# Altium schematic sheet POWER.SchDoc: POWER
size A3; Author: Silvio Navaretti; CompanyName: ARDUINO; DrawnBy: Silvio Navaretti; Engineer: Silvio Navaretti; Organization: ARDUINO; SheetNumber: 38; SheetTotal: 51; RevAuthor: Silvio Navaretti
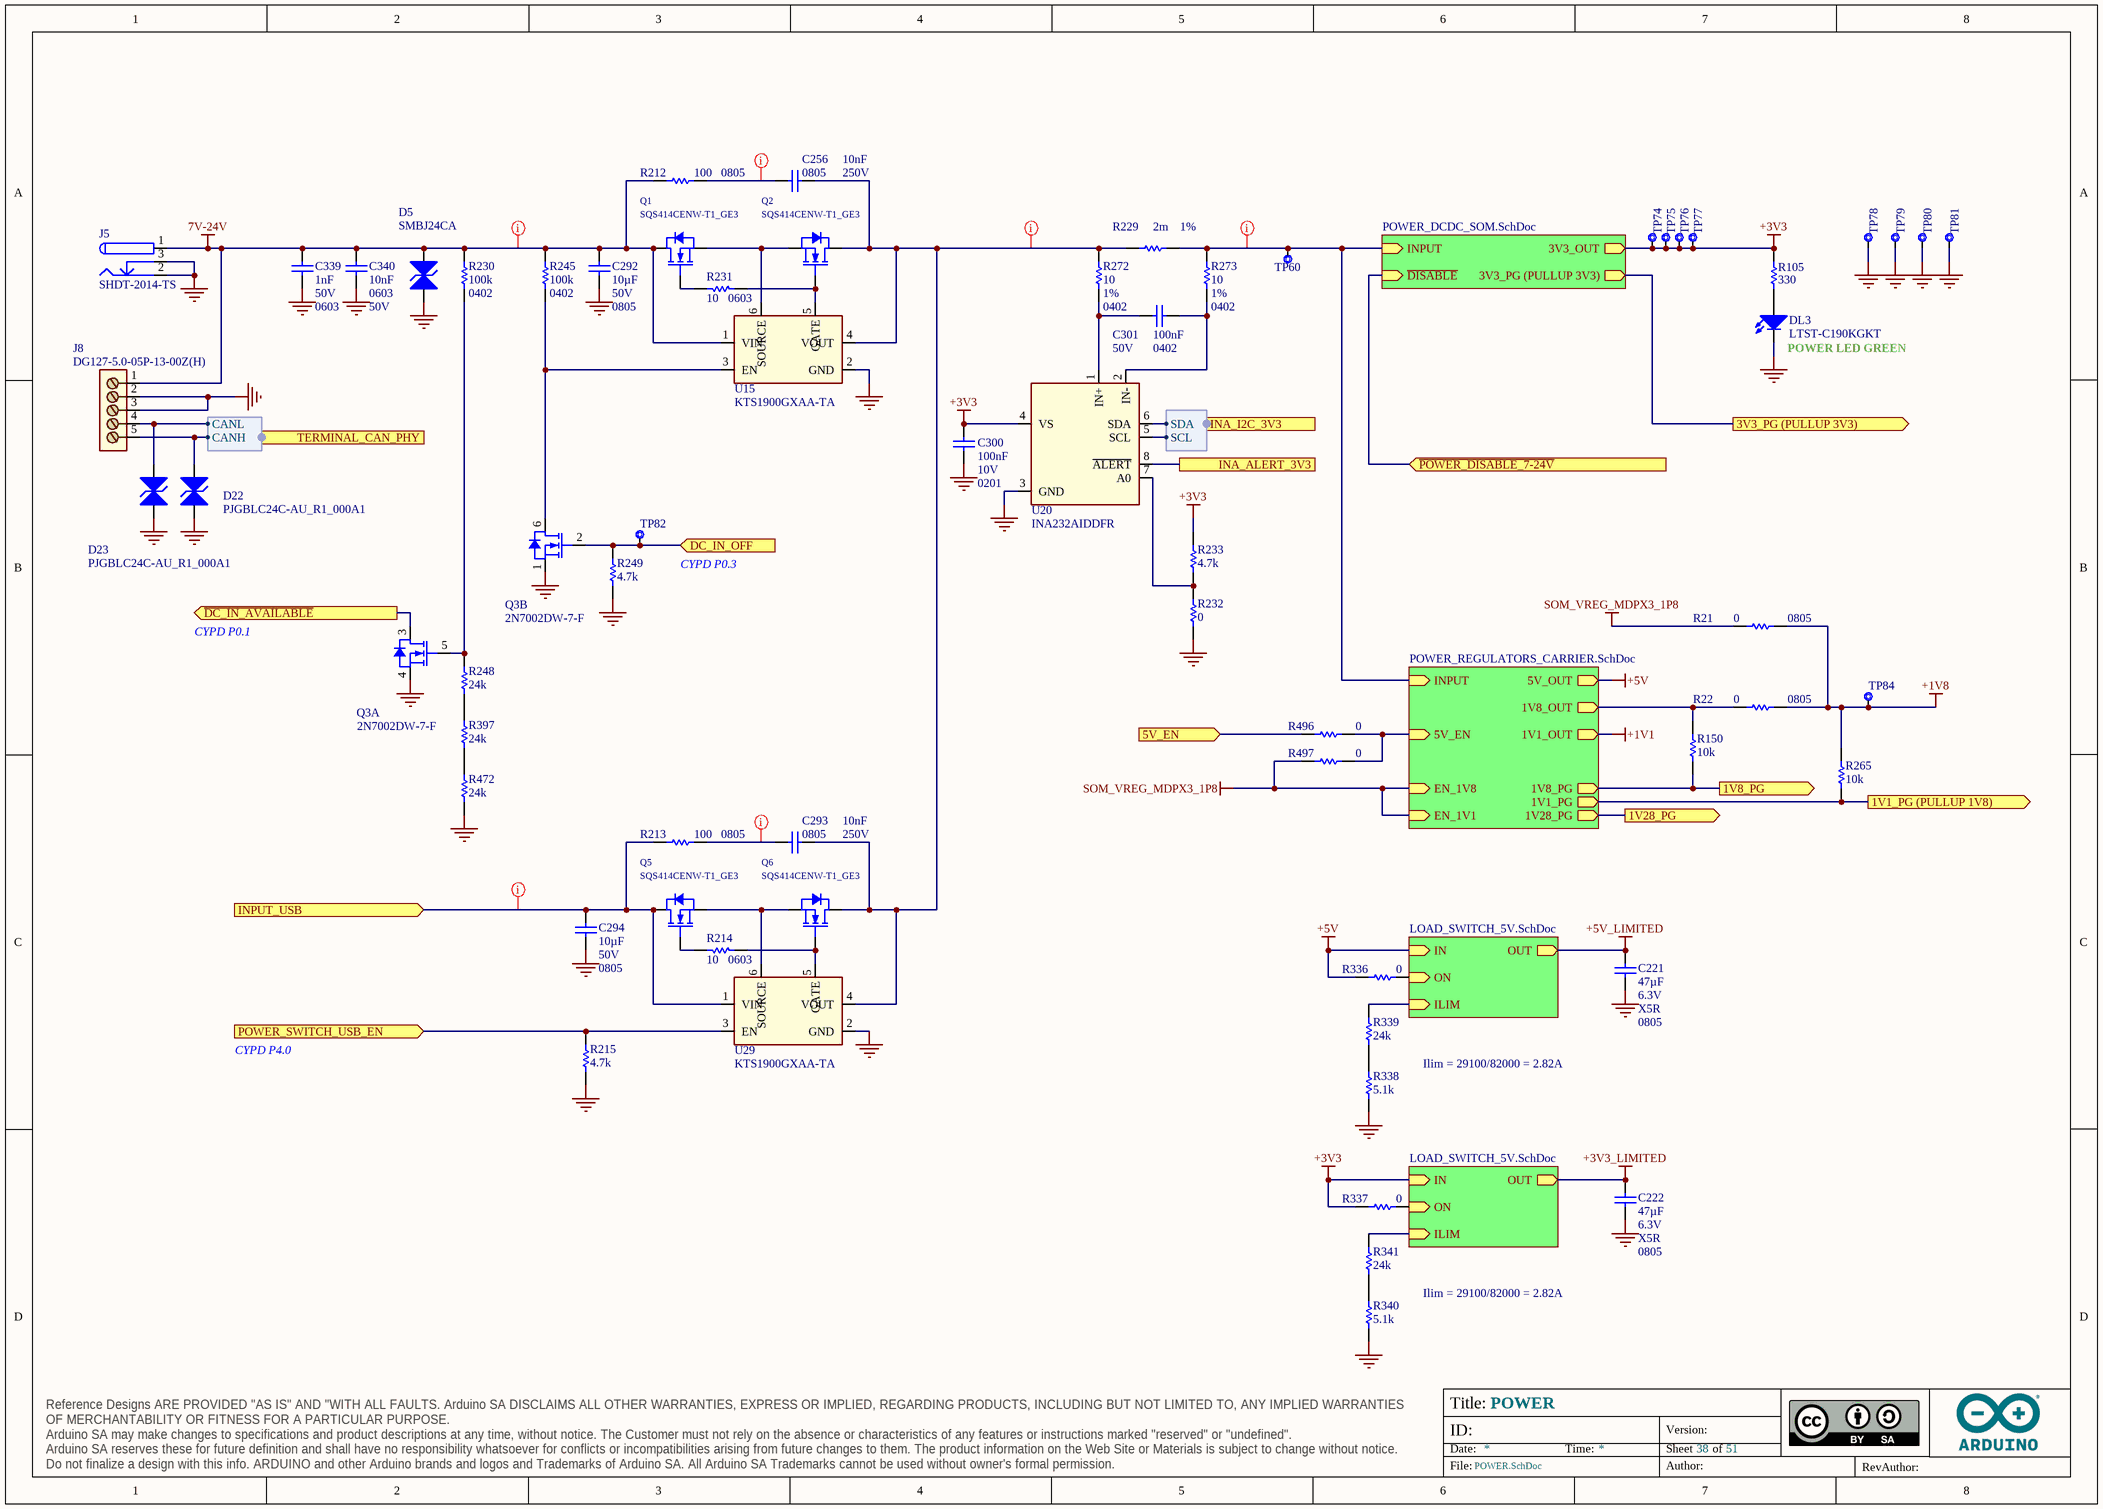
[diagram p0: POWER.SchDoc]

## Parts
C221  value 47µF  Voltage: 6.3V  Dielectric: X5R  Case Code (Imperial): 0805  [CAP-0805]  (hidden comment: C0805C476M9PAC7800)
C222  value 47µF  Voltage: 6.3V  Dielectric: X5R  Case Code (Imperial): 0805  [CAP-0805]  (hidden comment: C0805C476M9PAC7800)
C256  value 10nF  Case Code (Imperial): 0805  Voltage: 250V  [CAP-0805]  (hidden comment: GRM21BR72E103KW03L)
C292  value 10µF  Voltage: 50V  Case Code (Imperial): 0805  [CAP-0805]  (hidden comment: GRM21BR61H106ME43L)
C293  value 10nF  Case Code (Imperial): 0805  Voltage: 250V  [CAP-0805]  (hidden comment: GRM21BR72E103KW03L)
C294  value 10µF  Voltage: 50V  Case Code (Imperial): 0805  [CAP-0805]  (hidden comment: GRM21BR61H106ME43L)
C300  value 100nF  Voltage: 10V  Case Code (Imperial): 0201  [CAP-0201]  (hidden comment: CL03A104KP3NNNC)
C301  value 100nF  Voltage: 50V  Case Code (Imperial): 0402  [CAP-0402]  (hidden comment: GRM155R61H104KE19D)
C339  value 1nF  Voltage: 50V  Case Code (Imperial): 0603  [CAP-0603]  (hidden comment: CL10B102KB8WPNC)
C340  value 10nF  Case Code (Imperial): 0603  Voltage: 50V  [CAP-0603]  (hidden comment: 0603B103K500CT)
D5  SMBJ24CA  [SMB_NOPOLARITY]
D22  PJGBLC24C-AU_R1_000A1  [SOD323 NO POLARITY]
D23  PJGBLC24C-AU_R1_000A1  [SOD323 NO POLARITY]
DL3  LTST-C190KGKT  [LEDC1608X80N-AK]
J5  SHDT-2014-TS  [SHDT-2014-TS]
J8  DG127-5.0-05P-13-00Z(H)  [DG127-5.0-05P-13-00Z(H)]
Q1  SQS414CENW-T1_GE3  [SQS414CENW-T1_GE3]
Q2  SQS414CENW-T1_GE3  [SQS414CENW-T1_GE3]
Q3  2N7002DW-7-F  [SOT363]  (parts A,B of 2)
Q5  SQS414CENW-T1_GE3  [SQS414CENW-T1_GE3]
Q6  SQS414CENW-T1_GE3  [SQS414CENW-T1_GE3]
R21  value 0  Case Code (Imperial): 0805  [RES-0805]  (hidden comment: RC0805FR-070RL)
R22  value 0  Case Code (Imperial): 0805  [RES-0805]  (hidden comment: RC0805FR-070RL)
R105  value 330  [RES-0201]  (hidden comment: AC0201FR-07330RL)
R150  value 10k  [RES-0201]  (hidden comment: RC0201FR-0710KL)
R212  value 100  Case Code (Imperial): 0805  [RES-0805]  (hidden comment: RC0805FR-07100RL)
R213  value 100  Case Code (Imperial): 0805  [RES-0805]  (hidden comment: RC0805FR-07100RL)
R214  value 10  Case Code (Imperial): 0603  [RES-0603]  (hidden comment: CRCW060310R0FKEAC)
R215  value 4.7k  [RES-0201]  (hidden comment: RC0201FR-074K7L)
R229  value 2m  Tolerance: 1%  [RES-0805]  (hidden comment: PMR10EZPFV2L00)
R230  value 100k  Case Code (Imperial): 0402  [RES-0402]  (hidden comment: CRCW0402100KFKEDC)
R231  value 10  Case Code (Imperial): 0603  [RES-0603]  (hidden comment: CRCW060310R0FKEAC)
R232  value 0  [RES-0201]  (hidden comment: CRCW02010000Z0ED)
R233  value 4.7k  [RES-0201]  (hidden comment: RC0201FR-074K7L)
R245  value 100k  Case Code (Imperial): 0402  [RES-0402]  (hidden comment: CRCW0402100KFKEDC)
R248  value 24k  [RES-0201]  (hidden comment: RC0201FR-0724KL)
R249  value 4.7k  [RES-0201]  (hidden comment: RC0201FR-074K7L)
R265  value 10k  [RES-0201]  (hidden comment: RC0201FR-0710KL)
R272  value 10  Tolerance: 1%  Case Code (Imperial): 0402  [RES-0402]  (hidden comment: RC0402FR-0710RL)
R273  value 10  Tolerance: 1%  Case Code (Imperial): 0402  [RES-0402]  (hidden comment: RC0402FR-0710RL)
R336  value 0  [RES-0201]  (hidden comment: CRCW02010000Z0ED)
R337  value 0  [RES-0201]  (hidden comment: CRCW02010000Z0ED)
R338  value 5.1k  [RES-0201]  (hidden comment: ERJ-1GNF5101C)
R339  value 24k  [RES-0201]  (hidden comment: RC0201FR-0724KL)
R340  value 5.1k  [RES-0201]  (hidden comment: ERJ-1GNF5101C)
R341  value 24k  [RES-0201]  (hidden comment: RC0201FR-0724KL)
R397  value 24k  [RES-0201]  (hidden comment: RC0201FR-0724KL)
R472  value 24k  [RES-0201]  (hidden comment: RC0201FR-0724KL)
R496  value 0  [RES-0201]  (hidden comment: CRCW02010000Z0ED)
R497  value 0  [RES-0201]  (hidden comment: CRCW02010000Z0ED)
TP60  Test point 1.00mm  [TP-1.00MM]  (value not drawn)  (no BOM)
TP74  Test point 1.00mm  [TP-1.00MM]  (value not drawn)  (no BOM)
TP75  Test point 1.00mm  [TP-1.00MM]  (value not drawn)  (no BOM)
TP76  Test point 1.00mm  [TP-1.00MM]  (value not drawn)  (no BOM)
TP77  Test point 1.00mm  [TP-1.00MM]  (value not drawn)  (no BOM)
TP78  Test point 1.00mm  [TP-1.00MM]  (value not drawn)  (no BOM)
TP79  Test point 1.00mm  [TP-1.00MM]  (value not drawn)  (no BOM)
TP80  Test point 1.00mm  [TP-1.00MM]  (value not drawn)  (no BOM)
TP81  Test point 1.00mm  [TP-1.00MM]  (value not drawn)  (no BOM)
TP82  Test point 1.00mm  [TP-1.00MM]  (value not drawn)  (no BOM)
TP84  Test point 1.00mm  [TP-1.00MM]  (value not drawn)  (no BOM)
U15  KTS1900GXAA-TA  [SOT23-6 PITCH 0.95]
U20  INA232AIDDFR  [TI DDF SOT23-THIN 8 pin 1.6x2.9x1.1 mm heigth]
U29  KTS1900GXAA-TA  [SOT23-6 PITCH 0.95]

## Sub-sheets
U_LOAD_SWITCH_5V = LOAD_SWITCH_5V.SchDoc: IN (in), OUT (out), ON (in), ILIM (in)
U_LOAD_SWITCH_5V = LOAD_SWITCH_5V.SchDoc: IN (in), OUT (out), ON (in), ILIM (in)
U_POWER_DCDC_CARRIER = POWER_REGULATORS_CARRIER.SchDoc: INPUT (in), 5V_EN (in), 1V8_PG (out), 1V8_OUT (out), 1V1_OUT (out), 5V_OUT (out), 1V28_PG (out), 1V1_PG (out), EN_1V8 (in), EN_1V1 (in)
U_POWER_SOM = POWER_DCDC_SOM.SchDoc: 3V3_OUT (out), INPUT (in), ~{DISABLE} (in), 3V3_PG (PULLUP 3V3) (out)

## Ports
1V1_PG (PULLUP 1V8) (out), 1V8_PG (out), 1V28_PG (out), 3V3_PG (PULLUP 3V3) (out), 5V_EN (in), DC_IN_OFF (in), INA_ALERT_3V3, INA_I2C_3V3 (harness I2C), INPUT_USB (in), POWER_SWITCH_USB_EN (in), TERMINAL_CAN_PHY (harness CAN_PHY), ~{DC_IN_AVAILABLE} (out), ~{POWER_DISABLE_7-24V} (in)

## Harnesses
CAN_PHY: CANH, CANL
I2C: SDA, SCL

## Nets
7V-24V: C292.2 C339.1 C340.1 D5.2(A2) J5.1 J8.1 Q1.D R212.2 R230.1 R245.1 U15.1(VIN)
+1V1: sheet U_POWER_DCDC_CARRIER/1V1_OUT
+1V8: R21.2 R22.2 R265.1 TP84.X
+3V3: C300.2 R105.2 R233.1 R337.1 TP74.X TP75.X TP76.X TP77.X U20.4(VS) ; sheet U_POWER_SOM/3V3_OUT, sheet U_LOAD_SWITCH_5V/IN
+3V3_LIMITED: C222.2 ; sheet U_LOAD_SWITCH_5V/OUT
+5V: R336.1 ; sheet U_POWER_DCDC_CARRIER/5V_OUT, sheet U_LOAD_SWITCH_5V/IN
+5V_LIMITED: C221.2 ; sheet U_LOAD_SWITCH_5V/OUT
GND: C221.1 C222.1 C292.1 C294.1 C300.1 C339.2 C340.2 D5.1(A1) D22.1(A1) D23.1(A1) DL3.C J5.2 J5.3 J8.2 J8.3 Q3.1(S) Q3.4(S) R215.2 R232.1 R249.2 R338.1 R340.1 R472.1 TP78.X TP79.X TP80.X TP81.X U15.2(GND) U20.3(GND) U29.2(GND)
SOM_VREG_MDPX3_1P8: R21.1 R497.2 ; sheet U_POWER_DCDC_CARRIER/EN_1V8, sheet U_POWER_DCDC_CARRIER/EN_1V1
1V1_PG (PULLUP 1V8): R265.2 ; port 1V1_PG (PULLUP 1V8), sheet U_POWER_DCDC_CARRIER/1V1_PG
1V8_PG: R150.2 ; port 1V8_PG, sheet U_POWER_DCDC_CARRIER/1V8_PG
1V28_PG: port 1V28_PG, sheet U_POWER_DCDC_CARRIER/1V28_PG
3V3_PG (PULLUP 3V3): port 3V3_PG (PULLUP 3V3), sheet U_POWER_SOM/3V3_PG (PULLUP 3V3)
5V_EN: R496.2 ; port 5V_EN
~{DC_IN_AVAILABLE}: Q3.3(D) ; port ~{DC_IN_AVAILABLE}
DC_IN_OFF: Q3.2(G) R249.1 TP82.X ; port DC_IN_OFF
INA_ALERT_3V3: U20.8(~{ALERT}) ; port INA_ALERT_3V3
INPUT_USB: C294.2 Q5.D R213.2 U29.1(VIN) ; port INPUT_USB
~{POWER_DISABLE_7-24V}: port ~{POWER_DISABLE_7-24V}, sheet U_POWER_SOM/~{DISABLE}
POWER_SWITCH_USB_EN: R215.1 U29.3(EN) ; port POWER_SWITCH_USB_EN
NetC256_1: C256.1 R212.1
NetC256_2: C256.2 C293.2 Q2.D Q6.D R229.1 R272.2 U15.4(VOUT) U29.4(VOUT)
NetC293_1: C293.1 R213.1
NetC301_1: C301.1 R272.1 U20.1(IN+)
NetC301_2: C301.2 R273.1 U20.2(IN-)
NetD22_2: D22.2(A2) J8.5 ; port TERMINAL_CAN_PHY.CANH
NetD23_2: D23.2(A2) J8.4 ; port TERMINAL_CAN_PHY.CANL
NetDL3_A: DL3.A R105.1
NetQ1_G: Q1.G R231.2
NetQ1_S: Q1.S Q2.S U15.6(SOURCE)
NetQ2_G: Q2.G R231.1 U15.5(GATE)
NetQ3_5: Q3.5(G) R230.2 R248.2
NetQ3_6: Q3.6(D) R245.2 U15.3(EN)
NetQ5_G: Q5.G R214.2
NetQ5_S: Q5.S Q6.S U29.6(SOURCE)
NetQ6_G: Q6.G R214.1 U29.5(GATE)
NetR22_1: R22.1 R150.1 ; sheet U_POWER_DCDC_CARRIER/1V8_OUT
NetR229_2: R229.2 R273.2 TP60.X ; sheet U_POWER_SOM/INPUT, sheet U_POWER_DCDC_CARRIER/INPUT
NetR232_2: R232.2 R233.2 U20.7(A0)
NetR248_1: R248.1 R397.2
NetR336_2: R336.2 ; sheet U_LOAD_SWITCH_5V/ON
NetR337_2: R337.2 ; sheet U_LOAD_SWITCH_5V/ON
NetR338_2: R338.2 R339.1
NetR339_2: R339.2 ; sheet U_LOAD_SWITCH_5V/ILIM
NetR340_2: R340.2 R341.1
NetR341_2: R341.2 ; sheet U_LOAD_SWITCH_5V/ILIM
NetR397_1: R397.1 R472.2
NetR496_1: R496.1 R497.1 ; sheet U_POWER_DCDC_CARRIER/5V_EN
NetU20_5: U20.5(SCL) ; port INA_I2C_3V3.SCL
NetU20_6: U20.6(SDA) ; port INA_I2C_3V3.SDA

## Layout directives
net class HIGH_CLEARANCE: 7V-24V, INPUT_USB, NetC256_1, NetC256_2, NetC293_1, NetR229_2

## Notes on the sheet
- (near DL3) POWER LED GREEN
- CYPD P0.3
- CYPD P0.1
- CYPD P4.0
- Ilim = 29100/82000 = 2.82A
- Title:
- ID:
- Date:
- Time:
- Version:
- Sheet
- of
- RevAuthor:
- Reference Designs ARE PROVIDED "AS IS" AND "WITH ALL FAULTS. Arduino SA DISCLAIMS ALL OTHER WARRANTIES, EXPRESS OR IMPLIED, REGARDING PRODUCTS, INCLUDING BUT NOT LIMITED TO, ANY IMPLIED WARRANTIES OF MERCHANTABILITY OR FITNESS FOR A PARTICULAR PURPOSE.
  Arduino SA may make changes to specifications and product descriptions at any time, without notice. The Customer must not rely on the absence or characteristics of any features or instructions marked "reserved" or "undefined".
  Arduino SA reserves these for future definition and shall have no responsibility whatsoever for conflicts or incompatibilities arising from future changes to them. The product information on the Web Site or Materials is subject to change without notice.
  Do not finalize a design with this info. ARDUINO and other Arduino brands and logos and Trademarks of Arduino SA. All Arduino SA Trademarks cannot be used without owner's formal permission.
- File:
- Author:

## Library data of the parts
C221 C222 = C0199-A.1: CAP CHIP 0805 47uF 20% 6.3V X5R; Manufacturer: KEMET; Code Arduino: C0199; Technology: Ceramic; Tolerance: 20%; Part Number: C0805C476M9PAC7800
C256 C293 = C0209-A.1: CAP CHIP 0805 10nF 250V X7R; Manufacturer: Murata; Tolerance: 10%; Code Arduino: C0209; Part Number: GRM21BR72E103KW03L; Dielectric: X7R; Technology: Ceramic
C292 C294 = C0158-A.3: CAP CHIP 0805 10uF 20% 50V X5R; Manufacturer: Murata Electronics; Code Arduino: C0158; Dielectric: X5R; Technology: SMD; Part Number: GRM21BR61H106ME43L; Tolerance: 20%
C300 = C0113-A.6: CAP CHIP 0201 100nF 10% 10V X5R; Manufacturer: Samsung Electro-Mechanics; Code Arduino: C0113; Technology: Ceramic; Part Number: CL03A104KP3NNNC; Dielectric: X5R; Tolerance: 10%
C301 = C0015-A.14: CAP CHIP 0402 100nF 10% 50V X5R; Manufacturer: Murata; Code Arduino: A5141; Part Number: GRM155R61H104KE19D; Dielectric: X5R; Tolerance: 10%; Technology: Ceramic
C339 = C0063-A.3: CAP CHIP 0603 1nF 10% 50V X7R; Manufacturer: Samsung Electro-Mechanics; Code Arduino: C0063; Tolerance: 10%; Part Number: CL10B102KB8WPNC; Dielectric: X7R
C340 = C0040-A.14: CAP CHIP 0603 10nF 10% 50V X7R; Manufacturer: Walsin; Code Arduino: 0142; Technology: Ceramic; Part number 3: CL10B103KC8NNNC; Part Number: 0603B103K500CT; Dielectric: X7R; Manufacturer 2: Hottech; Part number 2: C1608B103K500NT; Tolerance: 10%
D5 = D0070-A.2: TVS BIDIRECTIONAL SMD Vr 24V, Vbr min 26.7V, 600W, SMB; Manufacturer: Littlefuse; V(BR) Typ (V): 26.7; Code Arduino: D0070; Manufacturer 2: Bourns; Part Number: SMBJ24CA; Manufacturer 3: Hottech
D22 D23 = D0098-A.2: TVS BIDIRECTIONAL SMD Vr 24V, Vbr min 27.27V, 350W, SOD-323; V(BR) Typ (V): 26.7; Code Arduino: D0098; Part Number: PJGBLC24C-AU_R1_000A1
DL3 = L0009-A.6: LED SMD 0603 GREEN/568 15mcd 120^; Manufacturer: Liteon; Code Arduino: 2204; Pin Count: 2; Part Number: LTST-C190KGKT
J5 = J0579-A.2: CONN PWR JACK TH 2.1X5.5mm 1.6mm PCB; Manufacturer: POWERWAY; Code Arduino: J0579; Part Number: SHDT-2014-TS
J8 = J0563-A.5: CONN SCREW TERMINAL 5 POS pitch 5mm height 13.6mm BLACK; Manufacturer: Degson; Code Arduino: J0563; Part Number: DG127-5.0-05P-13-00Z(H)
Q1 Q2 Q5 Q6 = T0065-2: MOSFET N-CH 60V 18A PowerPAK 1212-8W 3.3x3.3mm; Manufacturer: Vishay; Code Arduino: T0065; Part Number: SQS414CENW-T1_GE3
Q3 = T0011-A.12: MOSFET 2N-CH 60V 0.32A SOT363; Manufacturer: Diodes Inc.; Device Type: Mosfet 2N-CH SMD; Code Arduino: A5500; Manufacturer 2: Nexperia; Manufacturer Part Number 2: 2N7002PS,115; Pin Count: 6; Part Number: 2N7002DW-7-F
R21 R22 = R0323-A.1: RES CHIP 0805 0R 1% 1/8W; Manufacturer: YAGEO; Code Arduino: R0323; Power: 125mW; Temperature coefficient: 0ppm; Technology: Thick film; Part Number: RC0805FR-070RL; Tolerance: 1%
R105 = R0149-A.21: RES CHIP 0201 330R 1% 1/20W; Manufacturer: Yageo; Power: 50mW; Code Arduino: R0149; Temperature coefficient: 200ppm; Case Code (Imperial): 0201; Manufacturer 2: Samsung Electro-Mechanics; Tolerance: 1%; Part Number: AC0201FR-07330RL; Technology: Thick film
R150 R265 = R0145-A.21: RES CHIP 0201 10k 1% 1/20W; Manufacturer: Yageo; Power: 50mW; Temperature coefficient: 200ppm; Code Arduino: R0145; Manufacturer 2: Samsung Electro-Mechanics; Tolerance: 1%; Case Code (Imperial): 0201; Part Number: RC0201FR-0710KL; Technology: Thick film
R212 R213 = R0130-A.14: RES CHIP 0805 100R 1% 1/8W 100ppm; Manufacturer: YAGEO; Power: 125mW; Code Arduino: R0130; Part Number: RC0805FR-07100RL; Tolerance: 1%; Technology: Thick film; Temperature coefficient: 100ppm
R214 R231 = R0188-A.20: RES CHIP 0603 10R 1% 1/10W; Manufacturer: Vishay; Temperature coefficient: 100ppm; Code Arduino: R0188; Power: 100mW; Part Number: CRCW060310R0FKEAC; Tolerance: 1%; Technology: Thick film
R215 R233 R249 = R0151-A.21: RES CHIP 0201 4k7 1% 1/20W; Manufacturer: Yageo; Temperature coefficient: 200ppm; Power: 50mW; Code Arduino: A5521; Technology: Thick film; Case Code (Imperial): 0201; Part Number: RC0201FR-074K7L; Tolerance: 1%
R229 = R0132-A.12: RES CHIP 0805 2mR 1% 1/2W; Manufacturer: ROHM Semiconductor; Power: 500mW; Code Arduino: A5411; Temperature coefficient: 150ppm; Case Code (Imperial): 0805; Part Number: PMR10EZPFV2L00; Technology: Metal element
R230 R245 = R0001-A.24: RES CHIP 0402 100k 1% 1/16W; Manufacturer: Vishay; Power: 62.5mW; Code Arduino: 0134; Temperature coefficient: 100ppm; Tolerance: 1%; Part Number: CRCW0402100KFKEDC; Technology: Thick film
R232 R336 R337 R496 R497 = R0140-A.21: RES CHIP 0201 0R; Manufacturer: Vishay; Temperature coefficient: 0ppm; Code Arduino: R0140; Power: 50mW; Tolerance: 0%; Technology: Thick film; Case Code (Imperial): 0201; Part Number: CRCW02010000Z0ED
R248 R397 R472 = R0398-A.1: RES CHIP 0201 24k 1% 1/20W; Manufacturer: YAGEO; Power: 50mW; Code Arduino: R0398; Temperature Coefficient: 200ppm; Case Code (Imperial): 0201; Part Number: RC0201FR-0724KL; Technology: Thick film; Tolerance: 1%
R272 R273 = R0170-A.23: RES CHIP 0402 10R 1% 1/16W; Manufacturer: YAGEO; Power: 62.5mW; Temperature coefficient: 200ppm; Code Arduino: R0170; Technology: Thick film; Part Number: RC0402FR-0710RL
R338 R340 = R0376-A.1: RES CHIP 0201 5k1 1% 1/20W; Manufacturer: Panasonic; Code Arduino: R0376; Power: 50mW; Temperature Coefficient: 200ppm; Technology: Thick film; Part Number: ERJ-1GNF5101C; Case Code (Imperial): 0201; Tolerance: 1%
R339 R341 = R0398-A.1: RES CHIP 0201 24k 1% 1/20W; Manufacturer: YAGEO; Code Arduino: R0398; Power: 50mW; Temperature Coefficient: 200ppm; Technology: Thick film; Part Number: RC0201FR-0724KL; Case Code (Imperial): 0201; Tolerance: 1%
TP60 TP74-TP82 TP84 = UT0013-A.6: Part Number: This is not a component; Design Item ID: CMP-018-0005-A.3; Source: ut.SchLib; Manufacturer: This is not a component; Code Arduino: This is not a component; Pin Count: 1
U15 U29 = U0502-A.3: IC Ideal diode and load switch controller with reverse input protection, 4.2V to 60V, EN pin 1.32V, SOT23-6; Manufacturer: Kinetic Technology; Code Arduino: U0502; Part Number: KTS1900GXAA-TA
U20 = U0519-A.2: IC MONITOR PWR/CURR/VOLT 16bit ADC I2C SOT23-THIN8 1.6x2.9x1.1 mm; Manufacturer: Texas Instruments; Code Arduino: U0519; Part Number: INA232AIDDFR